# EAGLE schematic esquematico at led (EAGLE 6.5.0)
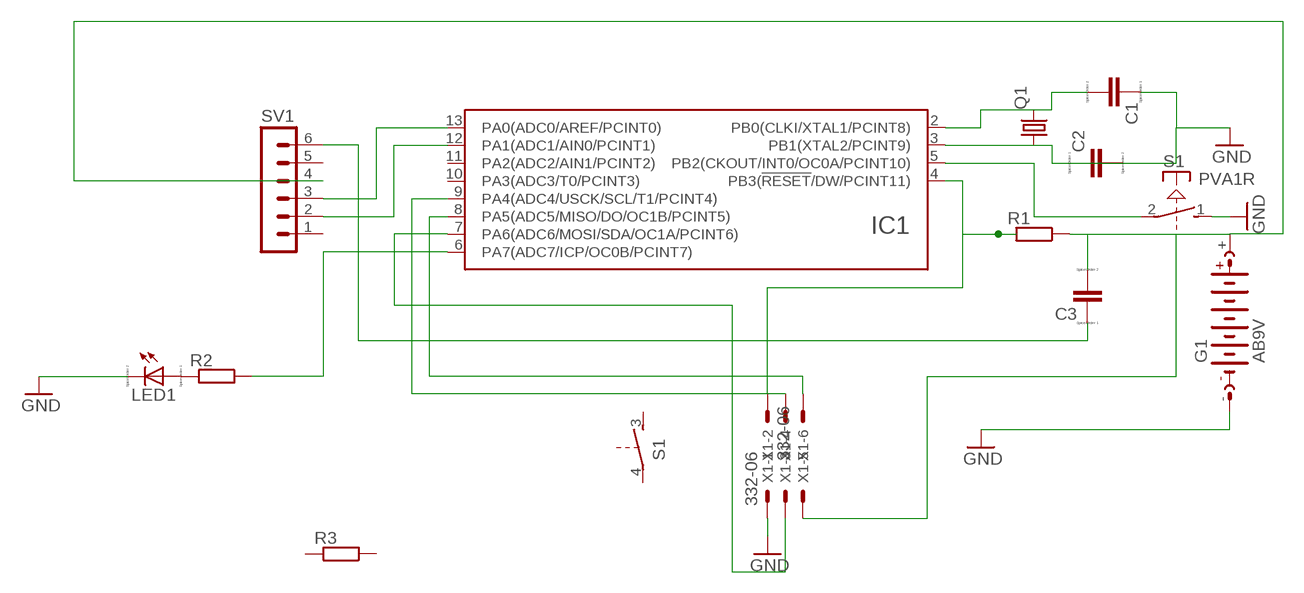
[diagram p0: schematic, sheet 1]

## Parts
C1  CC1206  [C1206]
C2  CC1206  [C1206]
C3  CC1206  [C1206]
G1  AB9V  [AB9V]
IC1  ATTINY24/44/84-SSU  [SOIC14]
LED1  LED_E  [LED_1206]
Q1  CRYSTALHC18U-V  [HC18U-V]
R1  BVS  [BVS]
R2  BVS  [BVS]
R3  BVS  [BVS]
S1  PVA1R  [PVA1R]
SV1  MA06-1  [MA06-1]
X1  332-06  [332-06]

## Nets
GND: C1.1 C2.1 C2.2 G1.- IC1.3(PB1(XTAL2/PCINT9)) LED1.C Q1.1 S1.1(1:S) X1.1
N$1: C1.2 IC1.2(PB0(CLKI/XTAL1/PCINT8)) Q1.2
N$2: IC1.13(PA0(ADC0/AREF/PCINT0)) SV1.3
N$3: SV1.4
N$4: IC1.12(PA1(ADC1/AIN0/PCINT1)) SV1.2
N$5: IC1.4(PB3(!RESET!/DW/PCINT11)) R1.2 X1.2
N$6: IC1.9(PA4(ADC4/USCK/SCL/T1/PCINT4)) X1.4
N$7: IC1.8(PA5(ADC5/MISO/DO/OC1B/PCINT5)) X1.6
N$8: C3.2 G1.+ R1.1 X1.5
N$9: IC1.7(PA6(ADC6/MOSI/SDA/OC1A/PCINT6)) X1.3
N$10: C3.1 SV1.6
N$11: IC1.5(PB2(CKOUT/INT0/OC0A/PCINT10)) S1.2(1:P)
N$12: IC1.6(PA7(ADC7/ICP/OC0B/PCINT7)) R2.1
N$13: LED1.A R2.2
Unconnected: IC1.10(PA3(ADC3/T0/PCINT3)) IC1.11(PA2(ADC2/AIN1/PCINT2)) R3.1 R3.2 S1.3(2:S) S1.4(2:P) SV1.1 SV1.5

## Power pins joined to a net without a drawn wire
GND: IC1.14(GND)
UCC: IC1.1(UCC)

## Library data of the parts
C1-C3 = eagle-ltspice:C: CAPACITOR, European symbol; SPICEMODEL: NONE; SPICEPREFIX: C
G1 = battery:AB9V: 9-V BATTERY CLIP
IC1 = atmel_tiny24-44-84tiny48-88mega48-88-168-328:ATTINY24/44/84
LED1 = eagle-ltspice:LED_E: LED Source: http://www.osram.convergy.de Source: www.luxeon.com Source: www.kingbright.com; SPICEMODEL: NONE; SPICEPREFIX: D; SPICETYPE: diode
Q1 = crystal:CRYSTAL: CRYSTAL; OC_FARNELL: unknown; OC_NEWARK: unknown
R1-R3 = resistor-shunt:BVS: SMD SHUNT RESISTOR; OC_FARNELL: unknown; OC_NEWARK: unknown
S1 = switch-misc:PVA1R: ITT SWITCH
SV1 = con-lstb:MA06-1: PIN HEADER; OC_FARNELL: unknown; OC_NEWARK: unknown
X1 = con-garry:332-06: 6 Pin - 2mm Dual Row Source: www.mpe-connector.de / garry_shortform_2012.pdf